# EAGLE board tf1230 (EAGLE 9.6.2), part 1 of 2
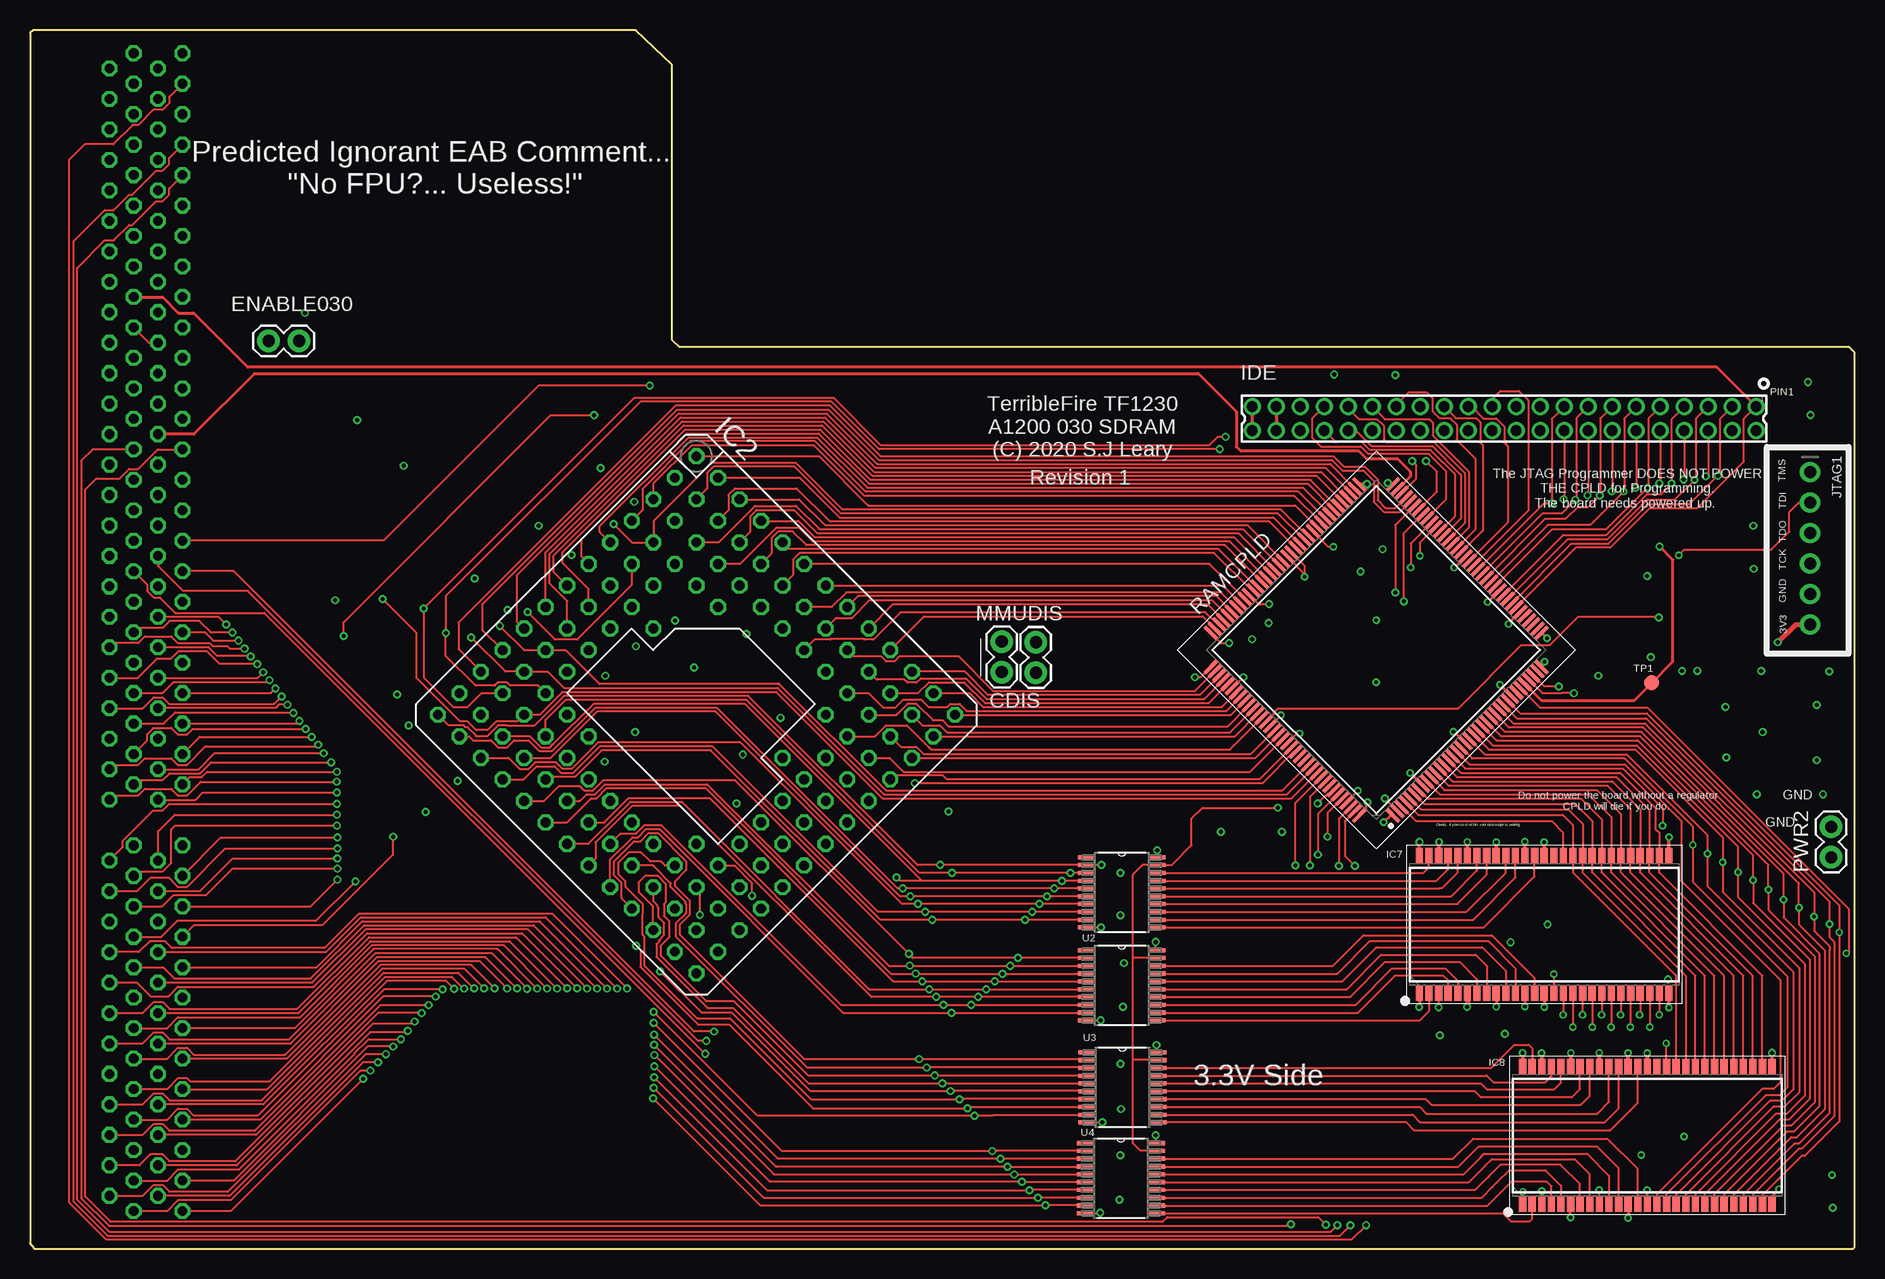
[diagram p7: board, top side]
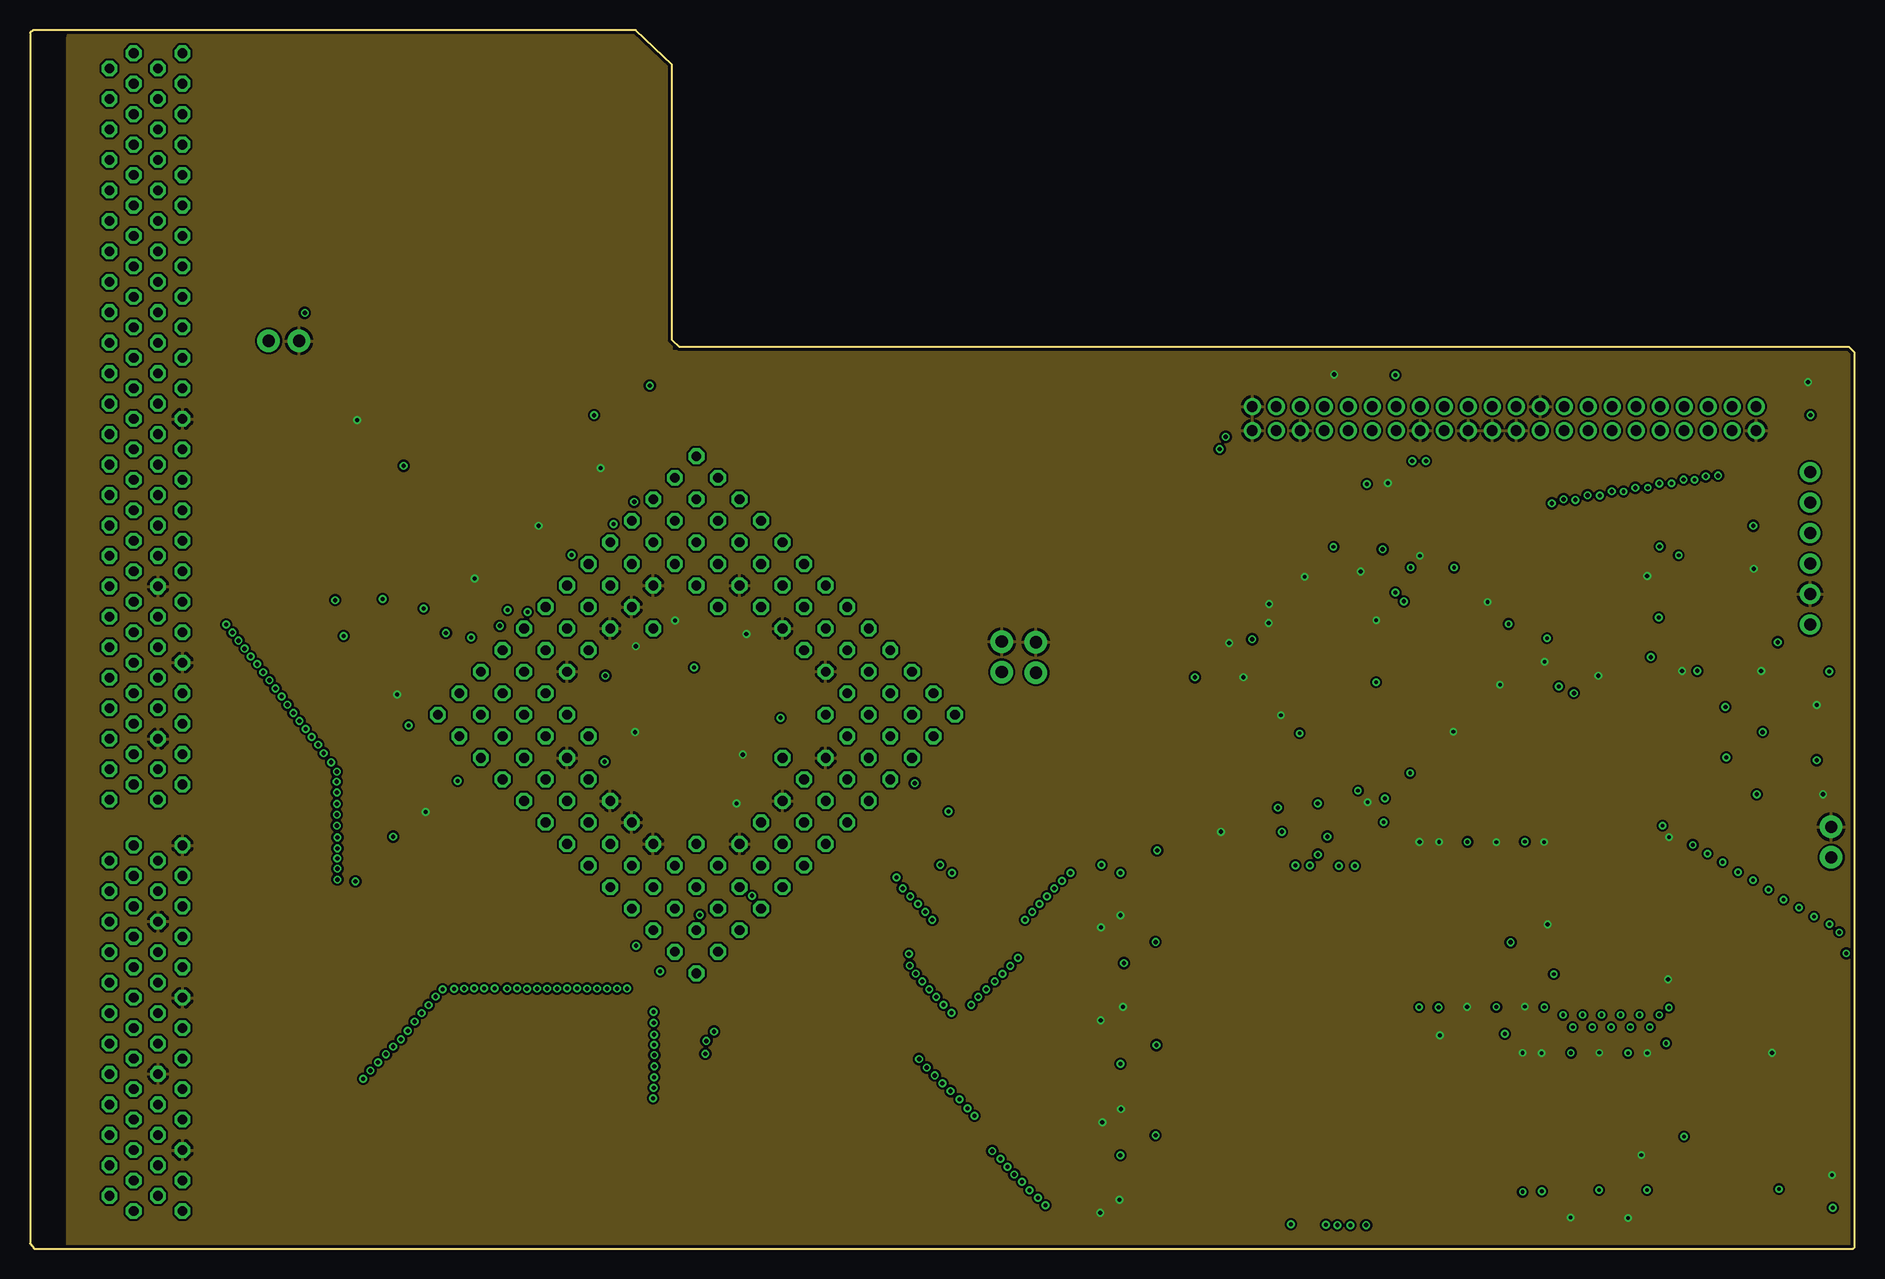
[diagram p8: board, inner layer GND]
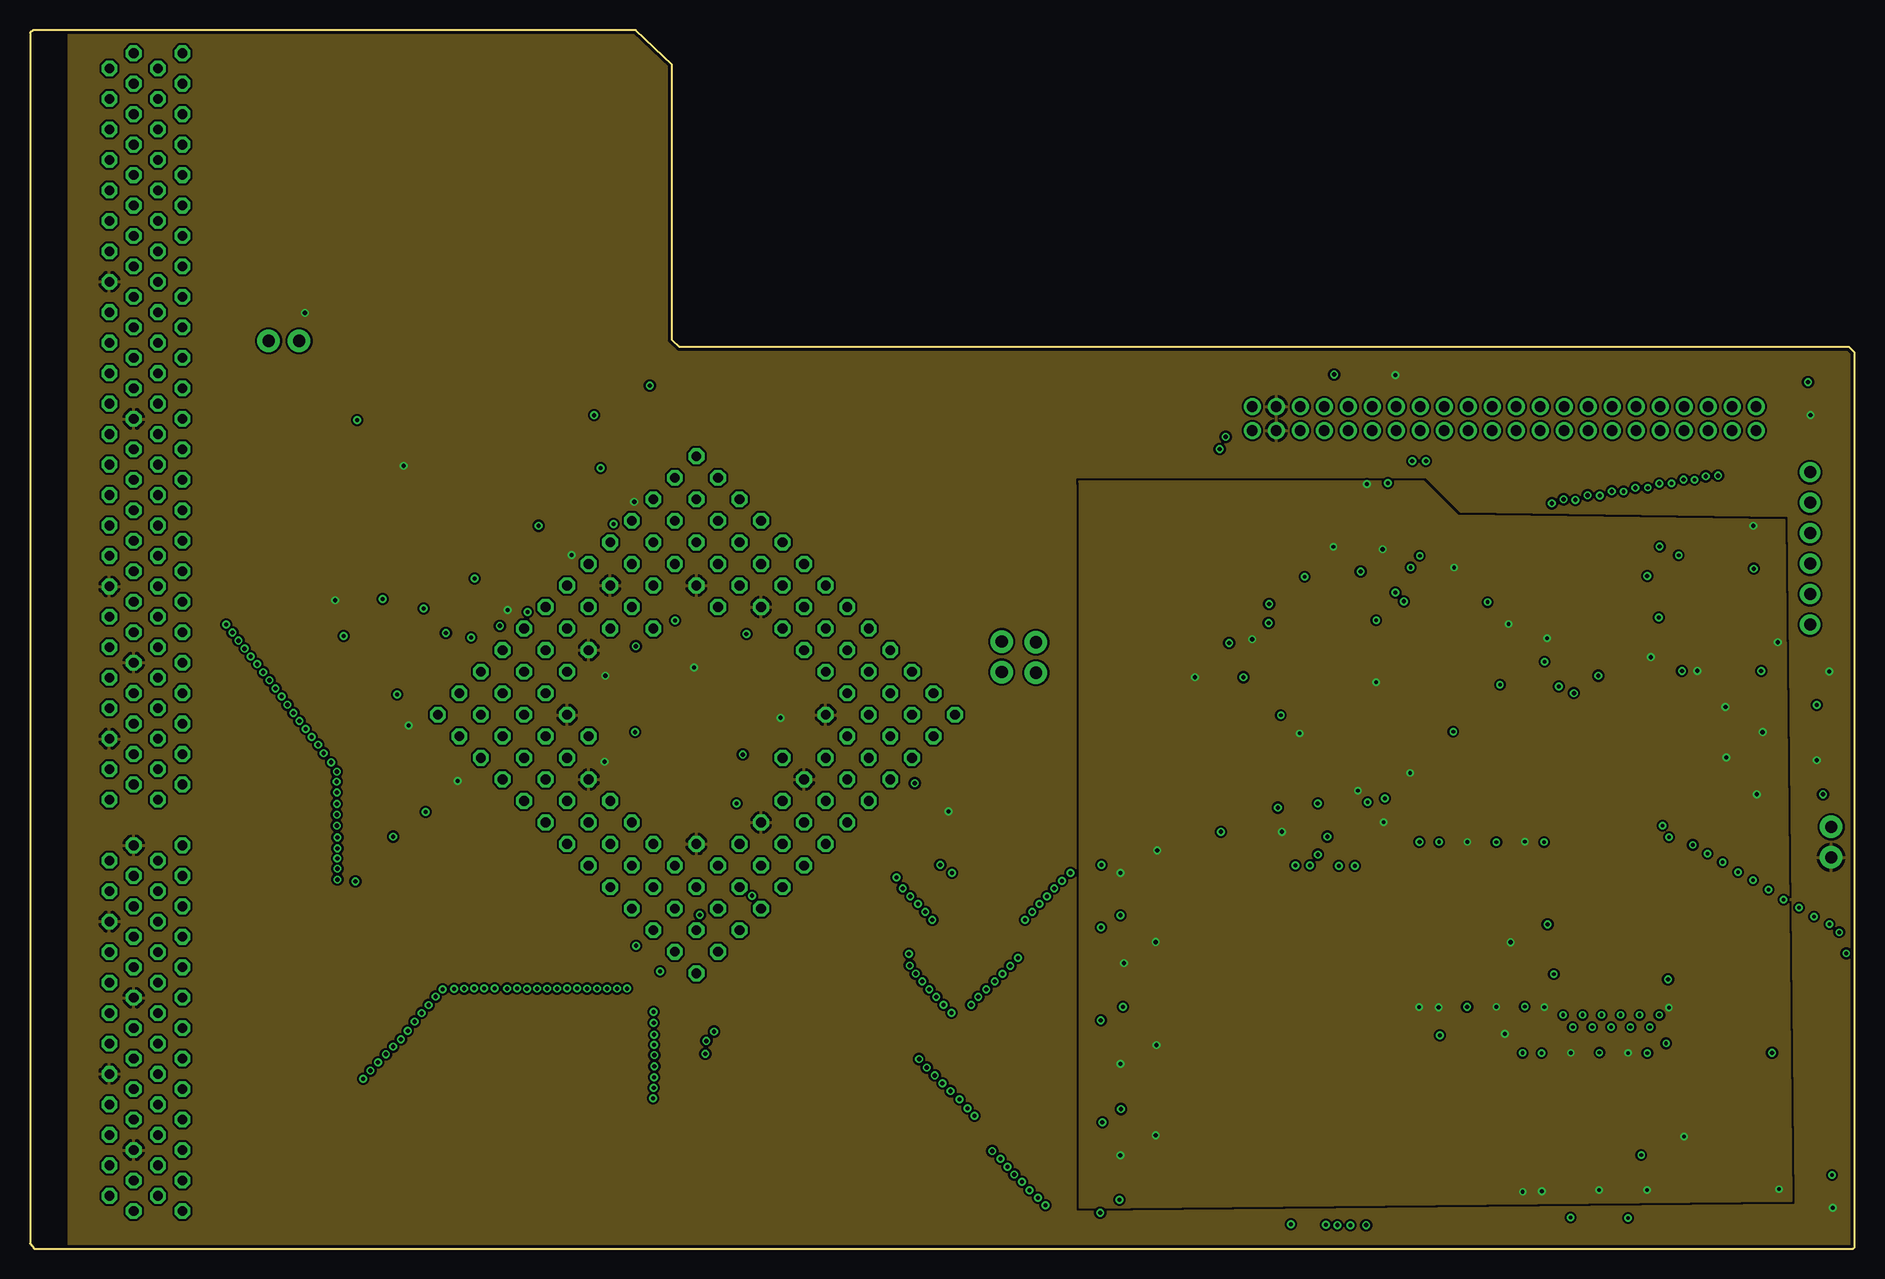
[diagram p9: board, inner layer PWR]
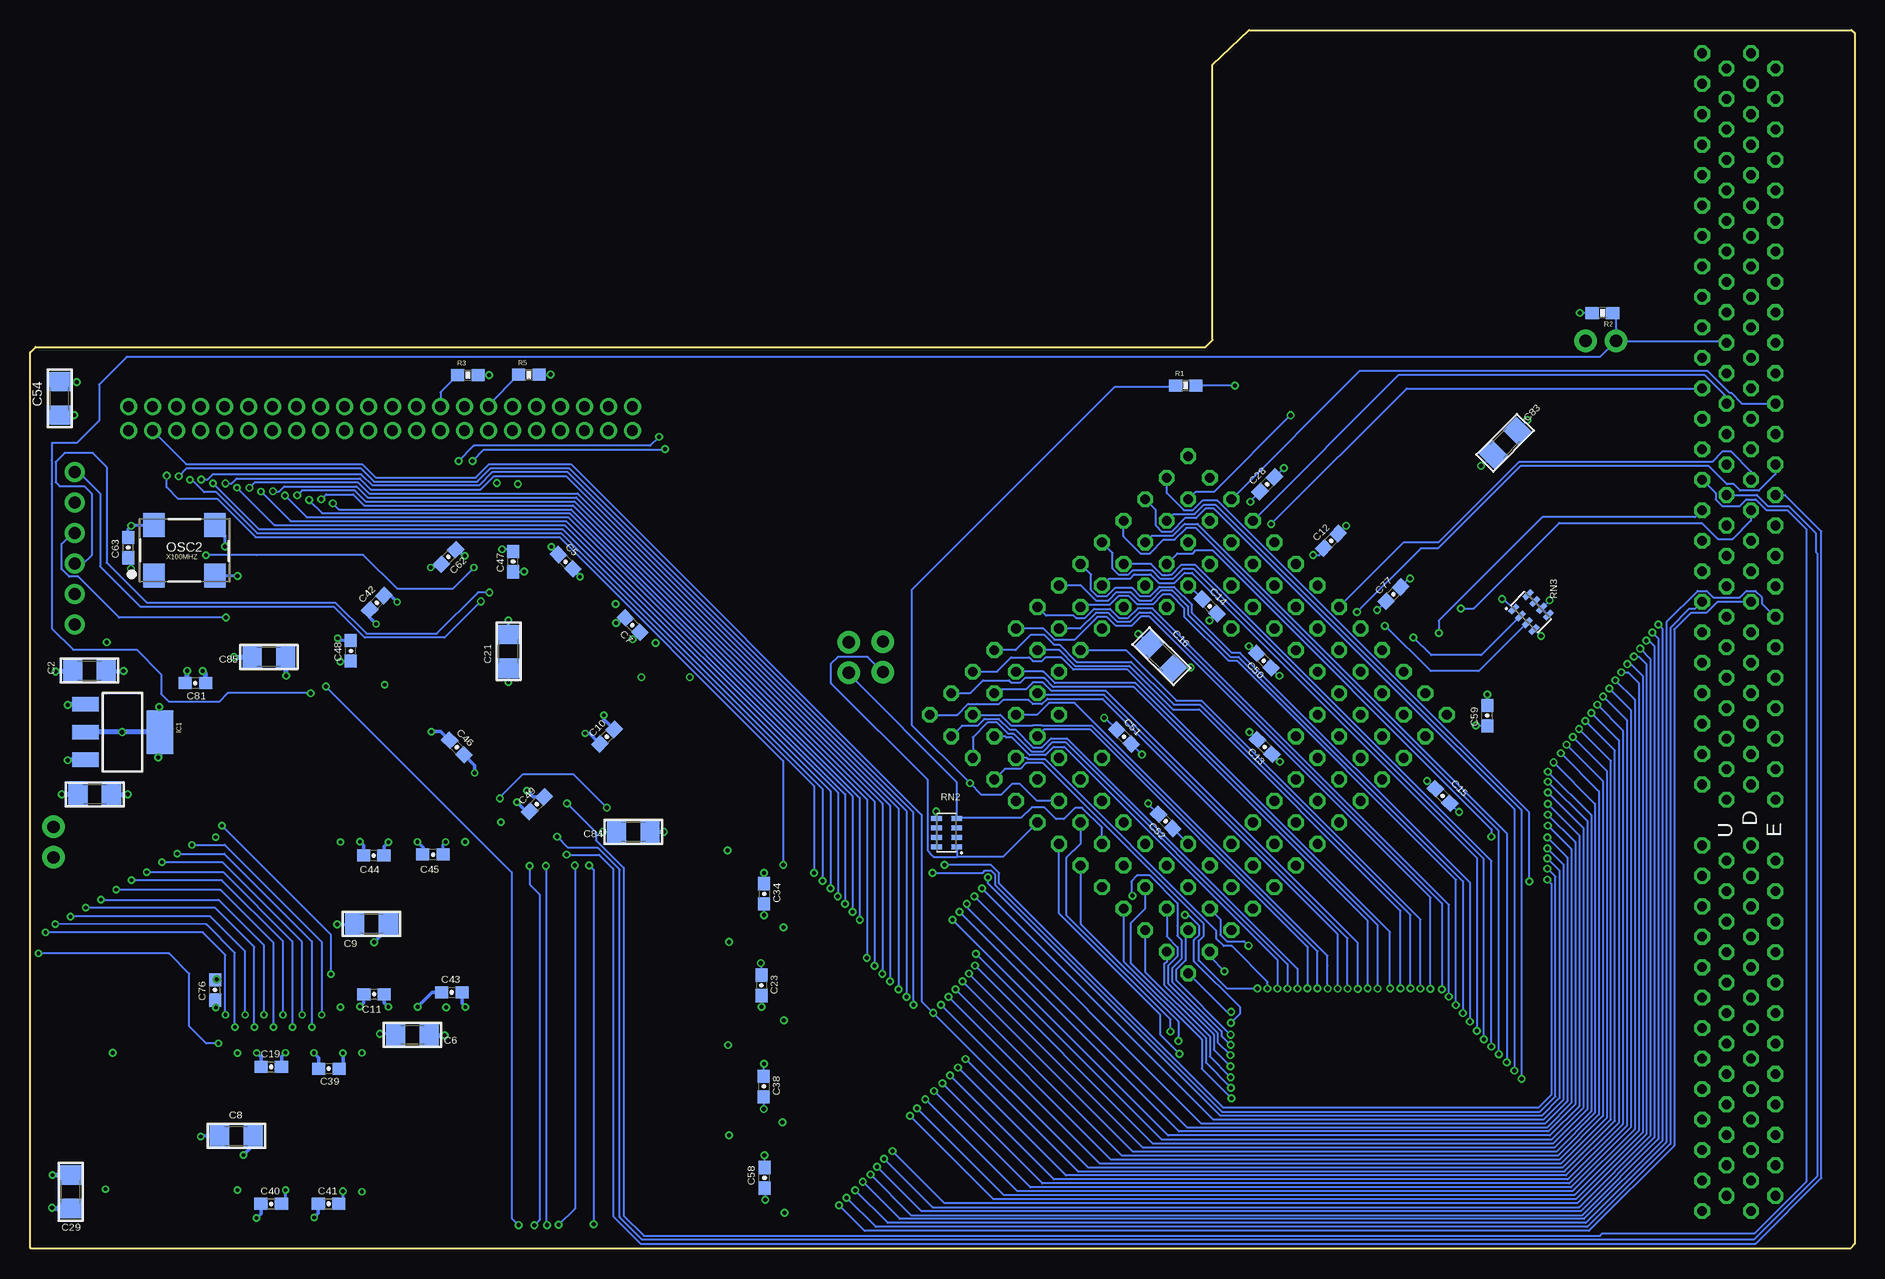
[diagram p10: board, bottom side, seen from below]

Size 152.1 x 101.59 mm. Coordinates in mm from the lower left corner, seen from the top.
Outline: 0.35,0 151.98,0 152.1,0.13 152.1,74.7 151.63,75.17 54.13,75.16 53.52,75.75 53.52,98.7 50.48,101.59 0.25,101.59 0,101.35 0,0.41 0.35,0
Copper layers (1*2*15*16): Top 0.035mm / dielectric 0.2mm / GND 0.0175mm / dielectric 1.2mm / PWR 0.0175mm / dielectric 0.2mm / Bottom 0.035mm
Design rules "dirtypcbs_4_layer *": minimum track width 6mil, minimum drill 12mil, track to track 7mil, track to pad 7mil, pad to pad 7mil, via to via 7mil, smd to smd 0mil, copper to edge 10mil, drill to drill 10mil, minimum pad ring 10mil, minimum via ring 6mil, stop-mask expansion 2mil, vias tented up to drill 25mil, thermal gap 10mil
Net classes: 1 vcc: width 0.457 mm; 3 gnd: width 0.254 mm

## Footprints (pad centres in the part's own frame; a part is rotated, then mirrored left to right if it is on the bottom)
1206 = smd 1.6 x 1.8: 1 -1.4,0; 2 1.4,0
0603-CAP = smd 1.1 x 1: 1 -0.85,0; 2 0.85,0
1X02 = drill 1.016 pad 1.88: 1 0,0; 2 2.54,0
AMIGA_CON_150 = drill 0.8 octagon: P$1 32.385,-3.81; P$2 32.385,0.254; P$3 31.115,-1.778; P$4 31.115,2.286; P$5 29.845,-3.81; P$6 29.845,0.254; P$7 28.575,-1.778; P$8 28.575,2.286; P$9 27.305,-3.81; P$10 27.305,0.254; P$11 26.035,-1.778; P$12 26.035,2.286; P$13 24.765,-3.81; P$14 24.765,0.254; P$15 23.495,-1.778; P$16 23.495,2.286; P$17 22.225,-3.81; P$18 22.225,0.254; P$19 20.955,-1.778; P$20 20.955,2.286; P$21 19.685,-3.81; P$22 19.685,0.254; P$23 18.415,-1.778; P$24 18.415,2.286; P$25 17.145,-3.81; P$26 17.145,0.254; P$27 15.875,-1.778; P$28 15.875,2.286; P$29 14.605,-3.81; P$30 14.605,0.254; P$31 13.335,-1.778; P$32 13.335,2.286; P$33 12.065,-3.81; P$34 12.065,0.254; P$35 10.795,-1.778; P$36 10.795,2.286; P$37 9.525,-3.81; P$38 9.525,0.254; P$39 8.255,-1.778; P$40 8.255,2.286; P$41 6.985,-3.81; P$42 6.985,0.254; P$43 5.715,-1.778; P$44 5.715,2.286; P$45 4.445,-3.81; P$46 4.445,0.254; P$47 3.175,-1.778; P$48 3.175,2.286; P$49 1.905,-3.81; P$50 1.905,0.254; P$51 -1.905,-1.778; P$52 -1.905,2.286; P$53 -3.175,-3.81; P$54 -3.175,0.254; P$55 -4.445,-1.778; P$56 -4.445,2.286; P$57 -5.715,-3.81; P$58 -5.715,0.254; P$59 -6.985,-1.778; P$60 -6.985,2.286; P$61 -8.255,-3.81; P$62 -8.255,0.254; P$63 -9.525,-1.778; P$64 -9.525,2.286; P$65 -10.795,-3.81; P$66 -10.795,0.254; P$67 -12.065,-1.778; P$68 -12.065,2.286; P$69 -13.335,-3.81; P$70 -13.335,0.254; P$71 -14.605,-1.778; P$72 -14.605,2.286; P$73 -15.875,-3.81; P$74 -15.875,0.254; P$75 -17.145,-1.778; P$76 -17.145,2.286; P$77 -18.415,-3.81; P$78 -18.415,0.254; P$79 -19.685,-1.778; P$80 -19.685,2.286; P$81 -20.955,-3.81; P$82 -20.955,0.254; P$83 -22.225,-1.778; P$84 -22.225,2.286; P$85 -23.495,-3.81; P$86 -23.495,0.254; P$87 -24.765,-1.778; P$88 -24.765,2.286; P$89 -26.035,-3.81; P$90 -26.035,0.254; P$91 -27.305,-1.778; P$92 -27.305,2.286; P$93 -28.575,-3.81; P$94 -28.575,0.254; P$95 -29.845,-1.778; P$96 -29.845,2.286; P$97 -31.115,-3.81; P$98 -31.115,0.254; P$99 -32.385,-1.778; P$100 -32.385,2.286; P$101 -33.655,-3.81; P$102 -33.655,0.254; P$103 -34.925,-1.778; P$104 -34.925,2.286; P$105 -36.195,-3.81; P$106 -36.195,0.254; P$107 -37.465,-1.778; P$108 -37.465,2.286; P$109 -38.735,-3.81; P$110 -38.735,0.254; P$111 -40.005,-1.778; P$112 -40.005,2.286; P$113 -41.275,-3.81; P$114 -41.275,0.254; P$115 -42.545,-1.778; P$116 -42.545,2.286; P$117 -43.815,-3.81; P$118 -43.815,0.254; P$119 -45.085,-1.778; P$120 -45.085,2.286; P$121 -46.355,-3.81; P$122 -46.355,0.254; P$123 -47.625,-1.778; P$124 -47.625,2.286; P$125 -48.895,-3.81; P$126 -48.895,0.254; P$127 -50.165,-1.778; P$128 -50.165,2.286; P$129 -51.435,-3.81; P$130 -51.435,0.254; P$131 -52.705,-1.778; P$132 -52.705,2.286; P$133 -53.975,-3.81; P$134 -53.975,0.254; P$135 -55.245,-1.778; P$136 -55.245,2.286; P$137 -56.515,-3.81; P$138 -56.515,0.254; P$139 -57.785,-1.778; P$140 -57.785,2.286; P$141 -59.055,-3.81; P$142 -59.055,0.254; P$143 -60.325,-1.778; P$144 -60.325,2.286; P$145 -61.595,-3.81; P$146 -61.595,0.254; P$147 -62.865,-1.778; P$148 -62.865,2.286; P$149 -64.135,-3.81; P$150 -64.135,0.254
SOT223 = smd 1.219 x 2.235: 1 -2.311,-3.099; 2 0,-3.099; 3 2.311,-3.099 | smd 3.6 x 2.2: 4 0,3.099
MPGA128 = drill 0.813 octagon: A01 -15.24,15.24; A02 -12.7,15.24; A03 -10.16,15.24; A04 -7.62,15.24; A05 -5.08,15.24; A06 -2.54,15.24; A07 0,15.24; A08 2.54,15.24; A09 5.08,15.24; A10 7.62,15.24; A11 10.16,15.24; A12 12.7,15.24; A13 15.24,15.24; B01 -15.24,12.7; B02 -12.7,12.7; B03 -10.16,12.7; B04 -7.62,12.7; B05 -5.08,12.7; B06 -2.54,12.7; B07 0,12.7; B08 2.54,12.7; B09 5.08,12.7; B10 7.62,12.7; B11 10.16,12.7; B12 12.7,12.7; B13 15.24,12.7; C01 -15.24,10.16; C02 -12.7,10.16; C03 -10.16,10.16; C04 -7.62,10.16; C05 -5.08,10.16; C06 -2.54,10.16; C07 0,10.16; C08 2.54,10.16; C09 5.08,10.16; C10 7.62,10.16; C11 10.16,10.16; C12 12.7,10.16; C13 15.24,10.16; D01 -15.24,7.62; D02 -12.7,7.62; D03 -10.16,7.62; D04 -7.62,7.62; D05 -5.08,7.62; D10 7.62,7.62; D11 10.16,7.62; D12 12.7,7.62; D13 15.24,7.62; E01 -15.24,5.08; E02 -12.7,5.08; E03 -10.16,5.08; E11 10.16,5.08; E12 12.7,5.08; E13 15.24,5.08; F01 -15.24,2.54; F02 -12.7,2.54; F03 -10.16,2.54; F04 -7.62,2.54; F10 7.62,2.54; F11 10.16,2.54; F12 12.7,2.54; F13 15.24,2.54; G01 -15.24,0; G02 -12.7,0; G03 -10.16,0; G11 10.16,0; G12 12.7,0; G13 15.24,0; H01 -15.24,-2.54; H02 -12.7,-2.54; H03 -10.16,-2.54; H11 10.16,-2.54; H12 12.7,-2.54; H13 15.24,-2.54; J01 -15.24,-5.08; J02 -12.7,-5.08; J03 -10.16,-5.08; J11 10.16,-5.08; J12 12.7,-5.08; J13 15.24,-5.08; K01 -15.24,-7.62; K02 -12.7,-7.62; K03 -10.16,-7.62; K04 -7.62,-7.62; K05 -5.08,-7.62; K10 7.62,-7.62; K11 10.16,-7.62; K12 12.7,-7.62; K13 15.24,-7.62; L01 -15.24,-10.16; L02 -12.7,-10.16; L03 -10.16,-10.16; L04 -7.62,-10.16; L05 -5.08,-10.16; L06 -2.54,-10.16; L07 0,-10.16; L08 2.54,-10.16; L09 5.08,-10.16; L10 7.62,-10.16; L11 10.16,-10.16; L12 12.7,-10.16; L13 15.24,-10.16; M01 -15.24,-12.7; M02 -12.7,-12.7; M03 -10.16,-12.7; M04 -7.62,-12.7; M05 -5.08,-12.7; M06 -2.54,-12.7; M07 0,-12.7; M08 2.54,-12.7; M09 5.08,-12.7; M10 7.62,-12.7; M11 10.16,-12.7; M12 12.7,-12.7; M13 15.24,-12.7; N01 -15.24,-15.24; N02 -12.7,-15.24; N03 -10.16,-15.24; N04 -7.62,-15.24; N05 -5.08,-15.24; N06 -2.54,-15.24; N07 0,-15.24; N08 2.54,-15.24; N09 5.08,-15.24; N10 7.62,-15.24; N11 10.16,-15.24; N12 12.7,-15.24; N13 15.24,-15.24
SOP80P1176X120-54N = smd 1.295 x 0.6: 1 -5.728,10.4; 2 -5.728,9.6; 3 -5.728,8.8; 4 -5.728,8; 5 -5.728,7.2; 6 -5.728,6.4; 7 -5.728,5.6; 8 -5.728,4.8; 9 -5.728,4; 10 -5.728,3.2; 11 -5.728,2.4; 12 -5.728,1.6; 13 -5.728,0.8; 14 -5.728,0; 15 -5.728,-0.8; 16 -5.728,-1.6; 17 -5.728,-2.4; 18 -5.728,-3.2; 19 -5.728,-4; 20 -5.728,-4.8; 21 -5.728,-5.6; 22 -5.728,-6.4; 23 -5.728,-7.2; 24 -5.728,-8; 25 -5.728,-8.8; 26 -5.728,-9.6; 27 -5.728,-10.4; 28 5.728,-10.4; 29 5.728,-9.6; 30 5.728,-8.8; 31 5.728,-8; 32 5.728,-7.2; 33 5.728,-6.4; 34 5.728,-5.6; 35 5.728,-4.8; 36 5.728,-4; 37 5.728,-3.2; 38 5.728,-2.4; 39 5.728,-1.6; 40 5.728,-0.8; 41 5.728,0; 42 5.728,0.8; 43 5.728,1.6; 44 5.728,2.4; 45 5.728,3.2; 46 5.728,4; 47 5.728,4.8; 48 5.728,5.6; 49 5.728,6.4; 50 5.728,7.2; 51 5.728,8; 52 5.728,8.8; 53 5.728,9.6; 54 5.728,10.4
87758-4416 = drill 0.9 pad 1.27: 1 -21,-1; 2 -21,1; 3 -19,-1; 4 -19,1; 5 -17,-1; 6 -17,1; 7 -15,-1; 8 -15,1; 9 -13,-1; 10 -13,1; 11 -11,-1; 12 -11,1; 13 -9,-1; 14 -9,1; 15 -7,-1; 16 -7,1; 17 -5,-1; 18 -5,1; 19 -3,-1; 20 -3,1; 21 -1,-1; 22 -1,1; 23 1,-1; 24 1,1; 25 3,-1; 26 3,1; 27 5,-1; 28 5,1; 29 7,-1; 30 7,1; 31 9,-1; 32 9,1; 33 11,-1; 34 11,1; 35 13,-1; 36 13,1; 37 15,-1; 38 15,1; 39 17,-1; 40 17,1; 41 19,-1; 42 19,1; 43 21,-1; 44 21,1
1X06_ROUND = drill 1 pad 1.676: 1 -6.35,0; 2 -3.81,0; 3 -1.27,0; 4 1.27,0; 5 3.81,0; 6 6.35,0
OSC_7X5MM = smd 1.8 x 2: 1 -2.54,-2.1; 2 2.54,-2.1; 3 2.54,2.1; 4 -2.54,2.1
0603 = smd 1.1 x 1: 1 -0.85,0; 2 0.85,0
SAMACSYS_PARTS_QFP50P2200X2200X160-144N = smd 1.475 x 0.3: 1 -10.738,8.75; 2 -10.738,8.25; 3 -10.738,7.75; 4 -10.738,7.25; 5 -10.738,6.75; 6 -10.738,6.25; 7 -10.738,5.75; 8 -10.738,5.25; 9 -10.738,4.75; 10 -10.738,4.25; 11 -10.738,3.75; 12 -10.738,3.25; 13 -10.738,2.75; 14 -10.738,2.25; 15 -10.738,1.75; 16 -10.738,1.25; 17 -10.738,0.75; 18 -10.738,0.25; 19 -10.738,-0.25; 20 -10.738,-0.75; 21 -10.738,-1.25; 22 -10.738,-1.75; 23 -10.738,-2.25; 24 -10.738,-2.75; 25 -10.738,-3.25; 26 -10.738,-3.75; 27 -10.738,-4.25; 28 -10.738,-4.75; 29 -10.738,-5.25; 30 -10.738,-5.75; 31 -10.738,-6.25; 32 -10.738,-6.75; 33 -10.738,-7.25; 34 -10.738,-7.75; 35 -10.738,-8.25; 36 -10.738,-8.75; 73 10.738,-8.75; 74 10.738,-8.25; 75 10.738,-7.75; 76 10.738,-7.25; 77 10.738,-6.75; 78 10.738,-6.25; 79 10.738,-5.75; 80 10.738,-5.25; 81 10.738,-4.75; 82 10.738,-4.25; 83 10.738,-3.75; 84 10.738,-3.25; 85 10.738,-2.75; 86 10.738,-2.25; 87 10.738,-1.75; 88 10.738,-1.25; 89 10.738,-0.75; 90 10.738,-0.25; 91 10.738,0.25; 92 10.738,0.75; 93 10.738,1.25; 94 10.738,1.75; 95 10.738,2.25; 96 10.738,2.75; 97 10.738,3.25; 98 10.738,3.75; 99 10.738,4.25; 100 10.738,4.75; 101 10.738,5.25; 102 10.738,5.75; 103 10.738,6.25; 104 10.738,6.75; 105 10.738,7.25; 106 10.738,7.75; 107 10.738,8.25; 108 10.738,8.75 | smd 0.3 x 1.475: 37 -8.75,-10.738; 38 -8.25,-10.738; 39 -7.75,-10.738; 40 -7.25,-10.738; 41 -6.75,-10.738; 42 -6.25,-10.738; 43 -5.75,-10.738; 44 -5.25,-10.738; 45 -4.75,-10.738; 46 -4.25,-10.738; 47 -3.75,-10.738; 48 -3.25,-10.738; 49 -2.75,-10.738; 50 -2.25,-10.738; 51 -1.75,-10.738; 52 -1.25,-10.738; 53 -0.75,-10.738; 54 -0.25,-10.738; 55 0.25,-10.738; 56 0.75,-10.738; 57 1.25,-10.738; 58 1.75,-10.738; 59 2.25,-10.738; 60 2.75,-10.738; 61 3.25,-10.738; 62 3.75,-10.738; 63 4.25,-10.738; 64 4.75,-10.738; 65 5.25,-10.738; 66 5.75,-10.738; 67 6.25,-10.738; 68 6.75,-10.738; 69 7.25,-10.738; 70 7.75,-10.738; 71 8.25,-10.738; 72 8.75,-10.738; 109 8.75,10.738; 110 8.25,10.738; 111 7.75,10.738; 112 7.25,10.738; 113 6.75,10.738; 114 6.25,10.738; 115 5.75,10.738; 116 5.25,10.738; 117 4.75,10.738; 118 4.25,10.738; 119 3.75,10.738; 120 3.25,10.738; 121 2.75,10.738; 122 2.25,10.738; 123 1.75,10.738; 124 1.25,10.738; 125 0.75,10.738; 126 0.25,10.738; 127 -0.25,10.738; 128 -0.75,10.738; 129 -1.25,10.738; 130 -1.75,10.738; 131 -2.25,10.738; 132 -2.75,10.738; 133 -3.25,10.738; 134 -3.75,10.738; 135 -4.25,10.738; 136 -4.75,10.738; 137 -5.25,10.738; 138 -5.75,10.738; 139 -6.25,10.738; 140 -6.75,10.738; 141 -7.25,10.738; 142 -7.75,10.738; 143 -8.25,10.738; 144 -8.75,10.738
RESCAXE80P320X160-8N = smd 0.9 x 0.425: 1 -0.85,1.2; 2 -0.85,0.4; 3 -0.85,-0.4; 4 -0.85,-1.2; 5 0.85,-1.2; 6 0.85,-0.4; 7 0.85,0.4; 8 0.85,1.2
B1,27 = smd 1.27 x 1.27: TP 0,0
SOP65P640X120-20N = smd 1.473 x 0.356: 1 -2.921,2.921; 2 -2.921,2.286; 3 -2.921,1.626; 4 -2.921,0.965; 5 -2.921,0.33; 6 -2.921,-0.33; 7 -2.921,-0.965; 8 -2.921,-1.626; 9 -2.921,-2.286; 10 -2.921,-2.921; 11 2.921,-2.921; 12 2.921,-2.286; 13 2.921,-1.626; 14 2.921,-0.965; 15 2.921,-0.33; 16 2.921,0.33; 17 2.921,0.965; 18 2.921,1.626; 19 2.921,2.286; 20 2.921,2.921

## Placement (x,y rotation side)
C1  10uF  [1206]  146.7,37.86 180 bottom
C2  10uF  [1206]  147.14,48.18 0 bottom
C5  0.1uF  [0603-CAP]  107.45,57.27 315 bottom
C6  10uF  [1206]  120.22,17.83 0 bottom
C7  0.1uF  [0603-CAP]  101.87,51.98 135 bottom
C8  1uF  [1206]  134.9,9.39 0 bottom
C9  1uF  [1206]  123.62,27.07 180 bottom
C10  0.1uF  [0603-CAP]  104,42.68 45 bottom
C11  0.1uF  [0603-CAP]  123.42,21.2 180 bottom
C12  0.1uF  [0603-CAP]  43.66,59 45 bottom
C13  0.1uF  [0603-CAP]  49.18,41.82 135 bottom
C14  0.1uF  [0603-CAP]  53.76,53.55 315 bottom
C15  0.1uF  [0603-CAP]  34.36,37.73 315 bottom
C16  22uF  [1206]  57.79,49.37 135 bottom
C19  0.1uF  [0603-CAP]  131.98,15.16 0 bottom
C21  1uF  [1206]  112.22,49.78 90 bottom
C23  0.1uF  [0603-CAP]  91.13,21.95 270 bottom
C28  0.1uF  [0603-CAP]  48.97,63.71 45 bottom
C29  22uF  [1206]  148.69,4.74 90 bottom
C34  0.1uF  [0603-CAP]  90.9,29.58 270 bottom
C38  0.1uF  [0603-CAP]  90.94,13.51 270 bottom
C39  0.1uF  [0603-CAP]  127.18,15 180 bottom
C40  0.1uF  [0603-CAP]  132,3.72 0 bottom
C41  0.1uF  [0603-CAP]  127.21,3.73 0 bottom
C42  0.1uF  [0603-CAP]  123.19,53.85 45 bottom
C43  0.1uF  [0603-CAP]  116.94,21.36 0 bottom
C44  0.1uF  [0603-CAP]  123.44,32.76 180 bottom
C45  0.1uF  [0603-CAP]  118.51,32.84 180 bottom
C46  0.1uF  [0603-CAP]  116.53,41.78 315 bottom
C47  0.1uF  [0603-CAP]  111.82,57.26 90 bottom
C48  0.1uF  [0603-CAP]  125.36,49.84 90 bottom
C49  0.1uF  [0603-CAP]  109.85,37.04 45 bottom
C50  0.1uF  [0603-CAP]  49.25,49.02 135 bottom
C51  0.1uF  [0603-CAP]  60.91,42.66 315 bottom
C52  0.1uF  [0603-CAP]  57.44,35.62 135 bottom
C54  22uF  [1206]  149.64,70.87 90 bottom
C58  0.1uF  [0603-CAP]  90.87,5.9 90 bottom
C59  0.1uF  [0603-CAP]  30.63,44.42 90 bottom
C62  0.1uF  [0603-CAP]  117.21,57.65 225 bottom
C63  50nF  [0603-CAP]  143.91,58.43 90 bottom
C76  0.1uF  [0603-CAP]  136.67,21.55 90 bottom
C77  0.1uF  [0603-CAP]  38.45,54.56 45 bottom
C81  0.1uF  [0603-CAP]  138.31,47.13 180 bottom
C83  10uF  [1206]  29.13,67.18 45 bottom
C84  1uF  [1206]  101.8,34.75 180 bottom
C85  1uF  [1206]  132.18,49.3 180 bottom
CDIS  CDIS  [1X02]  83.85,50.55 270 top
CN1  AMIGA_A1200-EXPANSION_SLOT  [AMIGA_CON_150]  8.9,35.51 270 bottom
ENABLE030  ENABLE  [1X02]  22.43,75.67 180 top
IC1  LM1117-3.3  [SOT223]  144.37,43.05 270 bottom
IC2  MC68030  [MPGA128]  55.55,44.5 315 top
IC7  AS4C32M16SA-7TCN  [SOP80P1176X120-54N]  126.21,27.02 90 top
IC8  AS4C32M16SA-7TCN  [SOP80P1176X120-54N]  134.81,9.44 90 top
IDE  87758-4416  [87758-4416]  122.88,69.19 180 top
JTAG1  JTAG  [1X06_ROUND]  148.38,58.37 270 top
MMUDIS  MMUDIS  [1X02]  81,50.6 270 top
OSC2  X100MHZ  [OSC_7X5MM]  139.22,58.2 0 bottom
PWR2  EXT5V  [1X02]  150.14,35.15 270 top
R1  1K  [0603]  55.75,71.96 0 bottom
R2  4K7  [0603]  21.03,78 180 bottom
R3  1K  [0603]  115.6,72.82 0 bottom
R5  1K  [0603]  110.52,72.85 0 bottom
RAMCPLD  XC95288XL-10TQG144I  [SAMACSYS_PARTS_QFP50P2200X2200X160-144N]  112.22,49.91 135 top
RN2  CAY16-103J4LF  [RESCAXE80P320X160-8N]  75.69,34.67 180 bottom
RN3  CAY16-103J4LF  [RESCAXE80P320X160-8N]  26.97,53.06 45 bottom
TP1  TPB1,27  [B1,27]  135.17,47.16 0 top
U1  SN74CB3T3245PW  [SOP65P640X120-20N]  91.01,29.69 0 top
U2  SN74CB3T3245PW  [SOP65P640X120-20N]  91.01,21.95 0 top
U3  SN74CB3T3245PW  [SOP65P640X120-20N]  91.06,13.44 0 top
U4  SN74CB3T3245PW  [SOP65P640X120-20N]  90.93,5.87 0 top